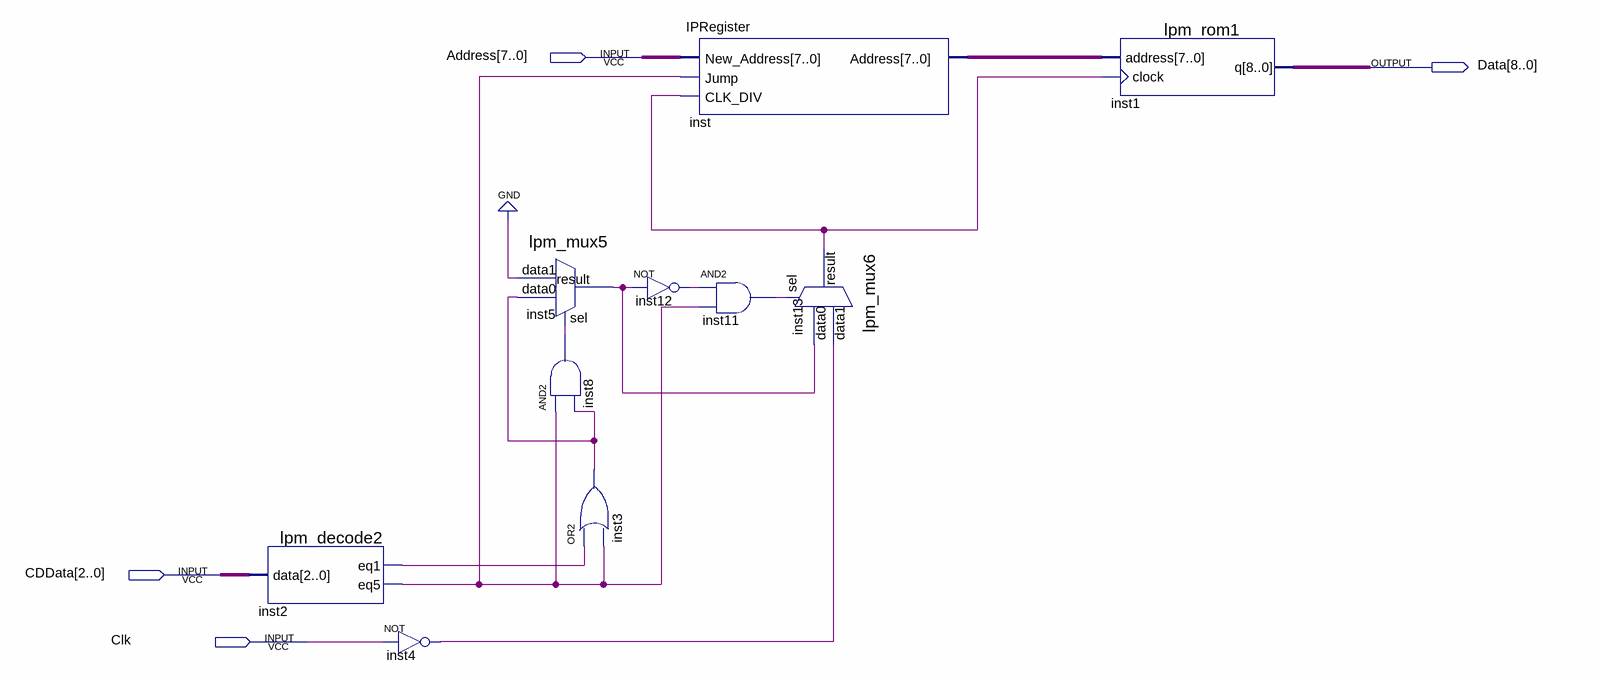
[diagram p0: schematic sheet]
// Quartus schematic ROM.bdf as structural Verilog: 10 symbols, 4 pins
module ROM (
  input  [7:0] Address,
  input  [2:0] CDData,
  input  Clk,
  output [8:0] Data
);

  wire inst2_eq1, inst2_eq5, inst3_out, inst4_out, inst5_result, inst8_out, inst11_out, inst12_out,
       inst13_result;
  wire [7:0] inst_address;

  lpm_decode2 inst2 (.data(CDData), .eq1(inst2_eq1), .eq5(inst2_eq5));
  not inst4 (inst4_out, Clk);
  lpm_mux5 inst5 (.data1(1'b0), .data0(inst3_out), .sel(inst8_out), .result(inst5_result));
  and inst8 (inst8_out, inst2_eq5, inst3_out);
  or inst3 (inst3_out, inst2_eq1, inst2_eq5);
  IPRegister inst (.New_Address(Address), .Jump(inst2_eq5), .CLK_DIV(inst13_result), .Address(inst_address));
  and inst11 (inst11_out, inst12_out, inst2_eq5);
  not inst12 (inst12_out, inst5_result);
  lpm_mux6 inst13 (.data1(inst4_out), .data0(inst5_result), .sel(inst11_out), .result(inst13_result));
  lpm_rom1 inst1 (.address(inst_address), .clock(inst13_result), .q(Data));
endmodule
